# EAGLE schematic digi-thermo (EAGLE 9.6.2)

## Sheet 1 of 3
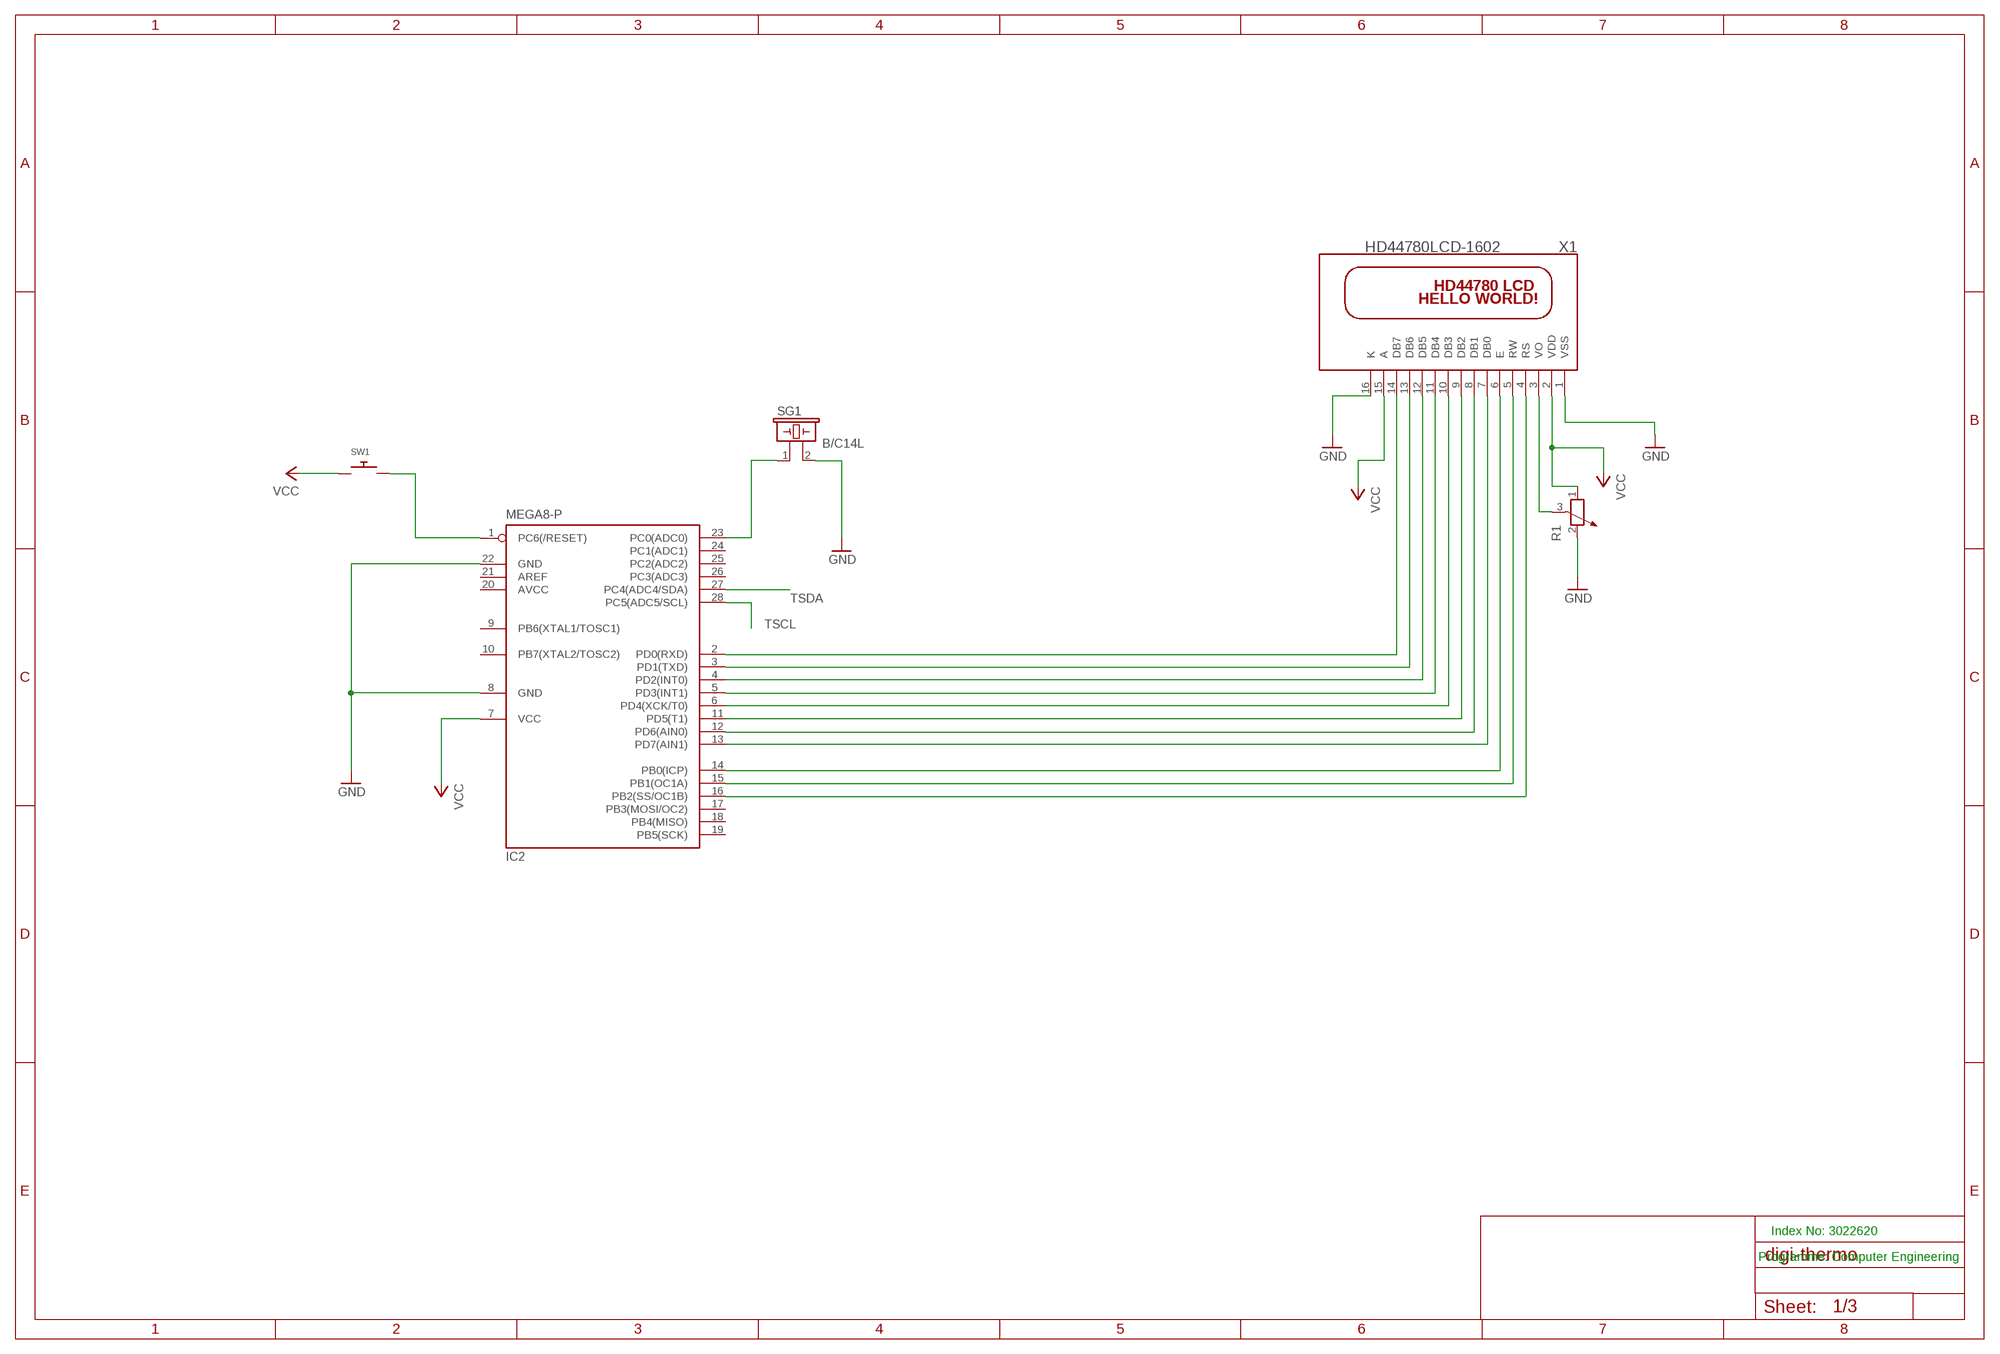
[diagram p0: schematic, sheet 1]

### Parts
IC2  MEGA8-P  [DIL28-3]
R1  POTENTIOMETER_PT-10  [PT-10]
SG1  B/C14L  [B/C14L]
SW1  SWITCH_PUSHBUTTONEVQ-PE  [TACT_PANA-EVQ]
X1  HD44780LCD-1602  [LCD1602]

### Nets
GND: IC2.8(GND) IC2.22(GND) R1.2 SG1.2 X1.1(VSS) X1.16(K)
N$1: IC2.23(PC0(ADC0)) SG1.1
N$2: IC2.1(PC6(/RESET)) SW1.P$2
N$3: IC2.13(PD7(AIN1)) X1.7(DB0)
N$7: IC2.12(PD6(AIN0)) X1.8(DB1)
N$8: IC2.11(PD5(T1)) X1.9(DB2)
N$9: IC2.2(PD0(RXD)) X1.14(DB7)
N$10: IC2.3(PD1(TXD)) X1.13(DB6)
N$11: IC2.4(PD2(INT0)) X1.12(DB5)
N$12: IC2.5(PD3(INT1)) X1.11(DB4)
N$13: IC2.6(PD4(XCK/T0)) X1.10(DB3)
N$14: R1.3 X1.3(VO)
N$17: IC2.16(PB2(SS/OC1B)) X1.4(RS)
N$18: IC2.15(PB1(OC1A)) X1.5(RW)
N$19: IC2.14(PB0(ICP)) X1.6(E)
TSCL: IC2.28(PC5(ADC5/SCL)) ; also sheet 3
TSDA: IC2.27(PC4(ADC4/SDA)) ; also sheet 3
VCC: IC2.7(VCC) R1.1 SW1.P$1 X1.2(VDD) X1.15(A) ; also sheet 3
Unconnected: IC2.9(PB6(XTAL1/TOSC1)) IC2.10(PB7(XTAL2/TOSC2)) IC2.17(PB3(MOSI/OC2)) IC2.18(PB4(MISO)) IC2.19(PB5(SCK)) IC2.21(AREF) IC2.24(PC1(ADC1)) IC2.25(PC2(ADC2)) IC2.26(PC3(ADC3))

### Notes on the sheet
- Index No: 3022620
- Programme: Computer Engineering

## Sheet 2 of 3: Power Unit
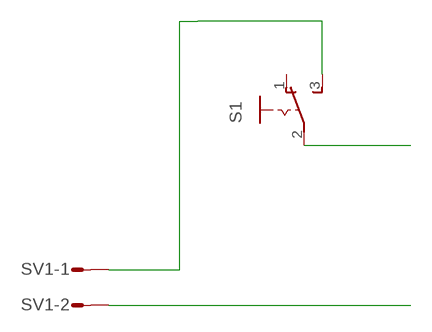
[diagram p1: schematic, sheet 2]

### Parts
S1  M251  [M251]
SV1  L02P  [L02P]

### Nets
N$4: S1.2(P)
N$5: SV1.2
N$6: S1.3(S) SV1.1
Unconnected: S1.1(O)

## Sheet 3 of 3: Sensor Unit
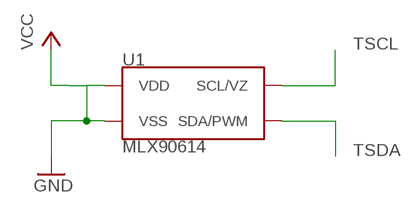
[diagram p2: schematic, sheet 3]

### Parts
U1  MLX90614  [TO-39]

### Nets
TSCL: U1.1(SCL/VZ) ; also sheet 1
TSDA: U1.2(SDA/PWM) ; also sheet 1
VCC: U1.3(VDD) U1.4(VSS) ; supply symbol labelled GND ; also sheet 1

## Power pins joined to a net without a drawn wire
AVCC: IC2.20(AVCC)

## Library data of the parts
IC2 = atmel:MEGA8-P: MICROCONTROLLER 8 Kbytes FLASH, 1 kbytes SRAM, 512 bytes EEPROM, USART, 4-channel 10 bit ADC, 2-channel 8 bit ADC Pin compatible with Atmega48, ATMega88, ATMega168 Source: avr.lbr; OC_FARNELL: unknown; OC_NEWARK: unknown
R1 = rcl:POTENTIOMETER_: Potentiometer; SPICEMODEL: POT; SPICEPREFIX: X
S1 = switch:M251: SLIDING SWITCH Mors, distributor Buerklin, 11G702
SG1 = buzzer:B/C14L: BUZZER Source: Buerklin; OC_FARNELL: unknown; OC_NEWARK: unknown
SV1 = con-amp-mt:L02P: AMP MT CONNECTOR; OC_FARNELL: unknown; OC_NEWARK: unknown
SW1 = adafruit:SWITCH_PUSHBUTTON: Buttons SOFTTOUCHSMD_SJ - Soft touch temporary push button (Super Junk Akihabara) Compatible with SKPMANE010 [Mouser: 688-SKPMAN] C&K_KSS = Digikey: KSS221GLFS
U1 = SparkFun-Sensors:MLX90614: Melexis MLX90614 Infrared (IR) Thermometer The MLX90614 is a passive infrared (PIR) I2C temperature sensor.It is designed for non-contact temperature sensing. An internal 17-bit ADC and a powerful DSP contribute to the MLX90614’s high accuracy and resolution. It has a huge number of applications including body temperature measurment and movement detection. Datasheet <http://www.sparkfun.com/datasheets/Sensors/Temperature/SEN-09570-datasheet-3901090614M005.pdf> SparkFun Products Infrared Thermometer - MLX90614 <https://www.sparkfun.com/products/9570> (SEN-09570) SparkFun IR Thermometer Evaluation Board - MLX90614 <https://www.sparkfun.com/products/10740> (SEN-10740); PROD_ID: COMP-09719; SF_ID: SEN-09570
X1 = adafruit:HD44780LCD: HD44780 LCD Standard character type LCDs, available in sizes from 8x1 to 40x4!